# Altium schematic sheet SUPERVISOR.SchDoc
size A4; Organization: My Company; Address1: Address Line 1; Address2: Address Line 2; Address3: Address Line 3; Address4: Address Line 4; SheetNumber: 7; SheetTotal: 7
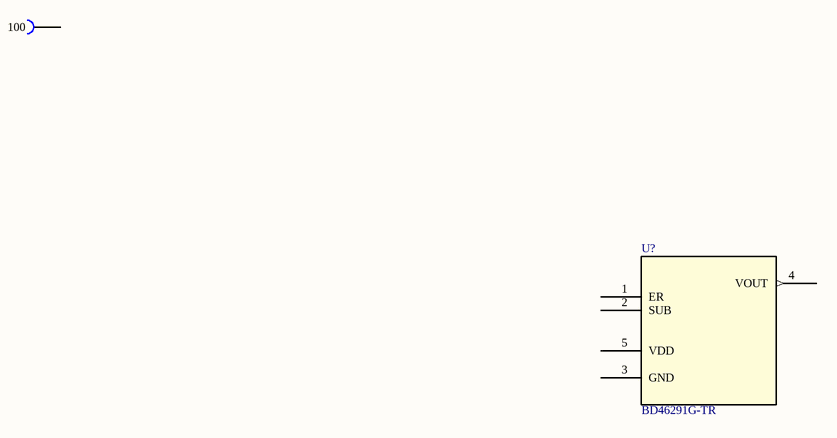
[diagram p0: SUPERVISOR.SchDoc]

## Parts
i.MX?  i.MX6_SoM  [i.MX6_SoM]  (value not drawn)  (part 100 of 159)  (no BOM)
U?  BD46291G-TR  [SSOP5_ROM]

## Nets

Not connected (* = marked no-connect by the designer): i.MX? 100; U? 1(ER) 2(SUB) 3(GND) 4(VOUT) 5(VDD)

## Notes on the sheet
- Title:
- Author:
- Approved:
- Size:
- Date:
- Git Hash:
- A4
- Prj:
- SW Version:
- Variant:
- Edited:
- CONFIDENTIAL
- File:

## Library data of the parts
U? = BD46291G-TR: No Description Available; SourceLibrary: ROHM_2019-10-21; Built_By: EMA_Molly; Vendor: ROHM Semiconductor; Copyright: Copyright (C) 2018 Accelerated Designs. All rights reserved; Manufacturer_Part_Number: BD46291G-TR; RefDes: RefDes; Type: DEV